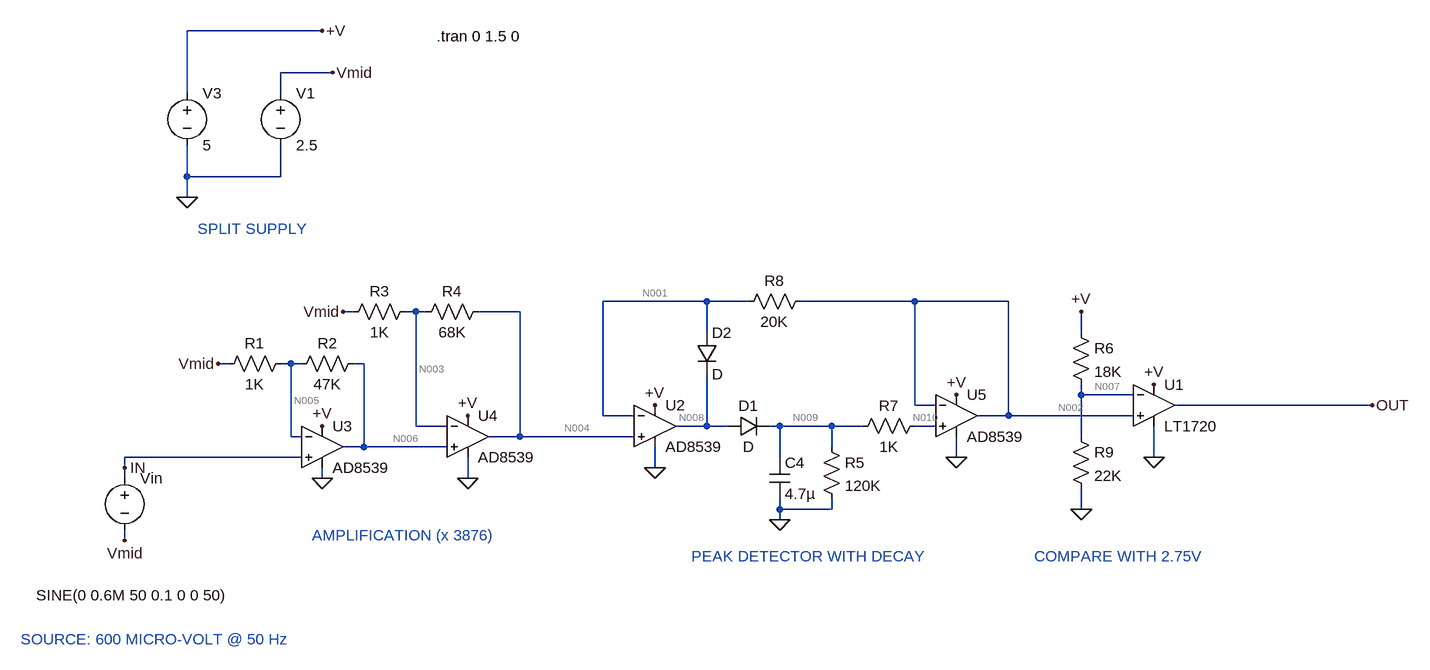
[diagram p0: schematic rogowski-coil-6.asc]
rogowski-coil-6.asc, the LTspice schematic file:
Version 4
SHEET 1 2500 700
WIRE 576 -1744 368 -1744
WIRE 592 -1680 512 -1680
WIRE 368 -1648 368 -1744
WIRE 512 -1648 512 -1680
WIRE 368 -1520 368 -1568
WIRE 512 -1520 512 -1568
WIRE 512 -1520 368 -1520
WIRE 368 -1488 368 -1520
WIRE 1168 -1328 1008 -1328
WIRE 1232 -1328 1168 -1328
WIRE 1488 -1328 1312 -1328
WIRE 1632 -1328 1488 -1328
WIRE 624 -1312 608 -1312
WIRE 720 -1312 704 -1312
WIRE 736 -1312 720 -1312
WIRE 880 -1312 816 -1312
WIRE 1168 -1280 1168 -1328
WIRE 1744 -1280 1744 -1312
WIRE 432 -1232 416 -1232
WIRE 528 -1232 512 -1232
WIRE 544 -1232 528 -1232
WIRE 640 -1232 624 -1232
WIRE 1744 -1184 1744 -1200
WIRE 1824 -1184 1744 -1184
WIRE 1488 -1168 1488 -1328
WIRE 1520 -1168 1488 -1168
WIRE 2192 -1168 1888 -1168
WIRE 1008 -1152 1008 -1328
WIRE 1056 -1152 1008 -1152
WIRE 1632 -1152 1632 -1328
WIRE 1632 -1152 1584 -1152
WIRE 1824 -1152 1632 -1152
WIRE 720 -1136 720 -1312
WIRE 768 -1136 720 -1136
WIRE 1168 -1136 1168 -1216
WIRE 1168 -1136 1120 -1136
WIRE 1200 -1136 1168 -1136
WIRE 1280 -1136 1264 -1136
WIRE 1360 -1136 1280 -1136
WIRE 1408 -1136 1360 -1136
WIRE 1520 -1136 1488 -1136
WIRE 528 -1120 528 -1232
WIRE 544 -1120 528 -1120
WIRE 880 -1120 880 -1312
WIRE 880 -1120 832 -1120
WIRE 1056 -1120 880 -1120
WIRE 1744 -1120 1744 -1184
WIRE 640 -1104 640 -1232
WIRE 640 -1104 608 -1104
WIRE 768 -1104 640 -1104
WIRE 1360 -1104 1360 -1136
WIRE 544 -1088 272 -1088
WIRE 1280 -1088 1280 -1136
WIRE 1552 -1088 1552 -1120
WIRE 1856 -1088 1856 -1136
WIRE 272 -1072 272 -1088
WIRE 1088 -1072 1088 -1104
WIRE 272 -1056 272 -1072
WIRE 576 -1056 576 -1072
WIRE 800 -1056 800 -1088
WIRE 1280 -1008 1280 -1024
WIRE 1360 -1008 1360 -1024
WIRE 1360 -1008 1280 -1008
WIRE 1744 -1008 1744 -1040
WIRE 1280 -992 1280 -1008
WIRE 272 -960 272 -976
FLAG 2192 -1168 OUT
FLAG 272 -1072 IN
FLAG 576 -1136 +V
FLAG 800 -1152 +V
FLAG 368 -1488 0
FLAG 576 -1744 +V
FLAG 592 -1680 Vmid
FLAG 576 -1056 0
FLAG 800 -1056 0
FLAG 608 -1312 Vmid
FLAG 416 -1232 Vmid
FLAG 272 -960 Vmid
FLAG 1088 -1168 +V
FLAG 1088 -1072 0
FLAG 1552 -1184 +V
FLAG 1552 -1088 0
FLAG 1280 -992 0
FLAG 1856 -1088 0
FLAG 1856 -1200 +V
FLAG 1744 -1312 +V
FLAG 1744 -1008 0
SYMBOL voltage 272 -1072 R0
WINDOW 123 24 146 Left 2
WINDOW 39 24 125 Left 2
WINDOW 3 -136 196 Left 2
SYMATTR Value SINE(0 0.6M 50 0.1 0 0 50)
SYMATTR InstName Vin
SYMBOL res 528 -1248 R90
WINDOW 0 0 56 VBottom 2
WINDOW 3 32 56 VTop 2
SYMATTR InstName R1
SYMATTR Value 1K
SYMBOL res 640 -1248 R90
WINDOW 0 0 56 VBottom 2
WINDOW 3 32 56 VTop 2
SYMATTR InstName R2
SYMATTR Value 47K
SYMBOL res 720 -1328 R90
WINDOW 0 0 56 VBottom 2
WINDOW 3 32 56 VTop 2
SYMATTR InstName R3
SYMATTR Value 1K
SYMBOL res 832 -1328 R90
WINDOW 0 0 56 VBottom 2
WINDOW 3 32 56 VTop 2
SYMATTR InstName R4
SYMATTR Value 68K
SYMBOL OpAmps\\AD8539 576 -1168 R0
SYMATTR InstName U3
SYMBOL OpAmps\\AD8539 800 -1184 R0
SYMATTR InstName U4
SYMBOL voltage 368 -1664 R0
WINDOW 123 0 0 Left 0
WINDOW 39 0 0 Left 0
SYMATTR InstName V3
SYMATTR Value 5
SYMBOL OpAmps\\AD8539 1088 -1200 R0
SYMATTR InstName U2
SYMBOL OpAmps\\AD8539 1552 -1216 R0
SYMATTR InstName U5
SYMBOL diode 1200 -1120 R270
WINDOW 0 32 32 VTop 2
WINDOW 3 0 32 VBottom 2
SYMATTR InstName D1
SYMBOL diode 1152 -1280 R0
SYMATTR InstName D2
SYMBOL res 1504 -1152 R90
WINDOW 0 0 56 VBottom 2
WINDOW 3 32 56 VTop 2
SYMATTR InstName R7
SYMATTR Value 1K
SYMBOL cap 1264 -1088 R0
SYMATTR InstName C4
SYMATTR Value 4.7µ
SYMBOL res 1328 -1344 R90
WINDOW 0 0 56 VBottom 2
WINDOW 3 32 56 VTop 2
SYMATTR InstName R8
SYMATTR Value 20K
SYMBOL voltage 512 -1664 R0
WINDOW 123 0 0 Left 0
WINDOW 39 0 0 Left 0
SYMATTR InstName V1
SYMATTR Value 2.5
SYMBOL res 1344 -1120 R0
SYMATTR InstName R5
SYMATTR Value 120K
SYMBOL Comparators\\LT1720 1856 -1232 R0
SYMATTR InstName U1
SYMBOL res 1728 -1296 R0
SYMATTR InstName R6
SYMATTR Value 18K
SYMBOL res 1728 -1136 R0
SYMATTR InstName R9
SYMATTR Value 22K
TEXT 752 -1736 Left 2 !.tran 0 1.5 0
TEXT 384 -1440 Left 2 ;SPLIT SUPPLY
TEXT 560 -968 Left 2 ;AMPLIFICATION (x 3876)
TEXT 112 -808 Left 2 ;SOURCE: 600 MICRO-VOLT @ 50 Hz
TEXT 1144 -936 Left 2 ;PEAK DETECTOR WITH DECAY
TEXT 1672 -936 Left 2 ;COMPARE WITH 2.75V

The netlist it stands for:
* rogowski-coil-6.asc
Vin IN Vmid SINE(0 0.6M 50 0.1 0 0 50)
R1 N005 Vmid 1K
R2 N006 N005 47K
R3 N003 Vmid 1K
R4 N004 N003 68K
XU3 IN N005 +V 0 N006 AD8539  ; pins In+ In- V+ V- OUT
XU4 N006 N003 +V 0 N004 AD8539  ; pins In+ In- V+ V- OUT
V3 +V 0 5
XU2 N004 N001 +V 0 N008 AD8539  ; pins In+ In- V+ V- OUT
XU5 N010 N002 +V 0 N002 AD8539  ; pins In+ In- V+ V- OUT
D1 N008 N009 D
D2 N001 N008 D
R7 N010 N009 1K
C4 N009 0 4.7µ
R8 N002 N001 20K
V1 Vmid 0 2.5
R5 N009 0 120K
XU1 N002 N007 +V 0 OUT LT1720  ; pins In+ In- V+ V- OUT
R6 +V N007 18K
R9 N007 0 22K
.model D D
.lib standard.dio
.tran 0 1.5 0
* SPLIT SUPPLY
* AMPLIFICATION (x 3876)
* SOURCE: 600 MICRO-VOLT @ 50 Hz
* PEAK DETECTOR WITH DECAY
* COMPARE WITH 2.75V
.lib LT1720.sub
.backanno
.end

* Results of the author's LTspice run, read from the files saved beside the schematic
* Operating Point, zero values left out:
*   V(in) = 2.5 V
*   V(vmid) = 2.5 V
*   V(n005) = 2.5 V
*   V(n006) = 2.501 V
*   V(n003) = 2.501 V
*   V(n004) = 2.546 V
*   V(+v) = 5 V
*   V(n001) = 2.546 V
*   V(n008) = 3.102 V
*   V(n002) = 2.546 V
*   V(n010) = 2.546 V
*   V(n009) = 2.546 V
*   V(n007) = 2.75 V
*   V(out) = 171.5 mV
*   I(D1) = 21.22 µA
*   I(R9) = 125 µA
*   I(R6) = 125 µA
*   I(R5) = 21.22 µA
*   I(R8) = -10.57 pA
*   I(R7) = -10 pA
*   I(R4) = 672.7 nA
*   I(R3) = 672.7 nA
*   I(R2) = 13.73 nA
*   I(R1) = 13.74 nA
*   I(V1) = 686.4 nA
*   I(V3) = -4.714 mA
*   I(Vin) = -10 pA
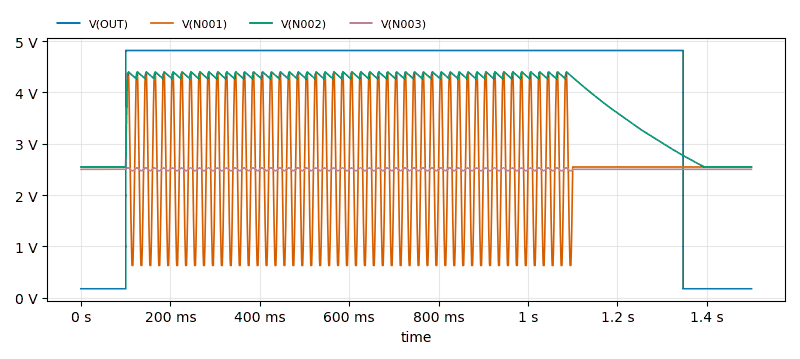
[diagram p1: Transient Analysis of rogowski-coil-6.asc, plotted from the saved traces]
* Transient Analysis, 1 run:
*   V(OUT): min 171.2 mV, max 4.821 V, average 4.034 V, rms 4.393 V, last 171.5 mV
*   V(N001): min 625.8 mV, max 4.399 V, average 2.539 V, rms 2.778 V, last 2.546 V
*   V(N002): min 2.545 V, max 4.399 V, average 3.896 V, rms 3.958 V, last 2.546 V
*   V(N003): min 2.472 V, max 2.529 V, average 2.501 V, rms 2.501 V, last 2.501 V